# Altium schematic sheet system_bus.SchDoc
size A4
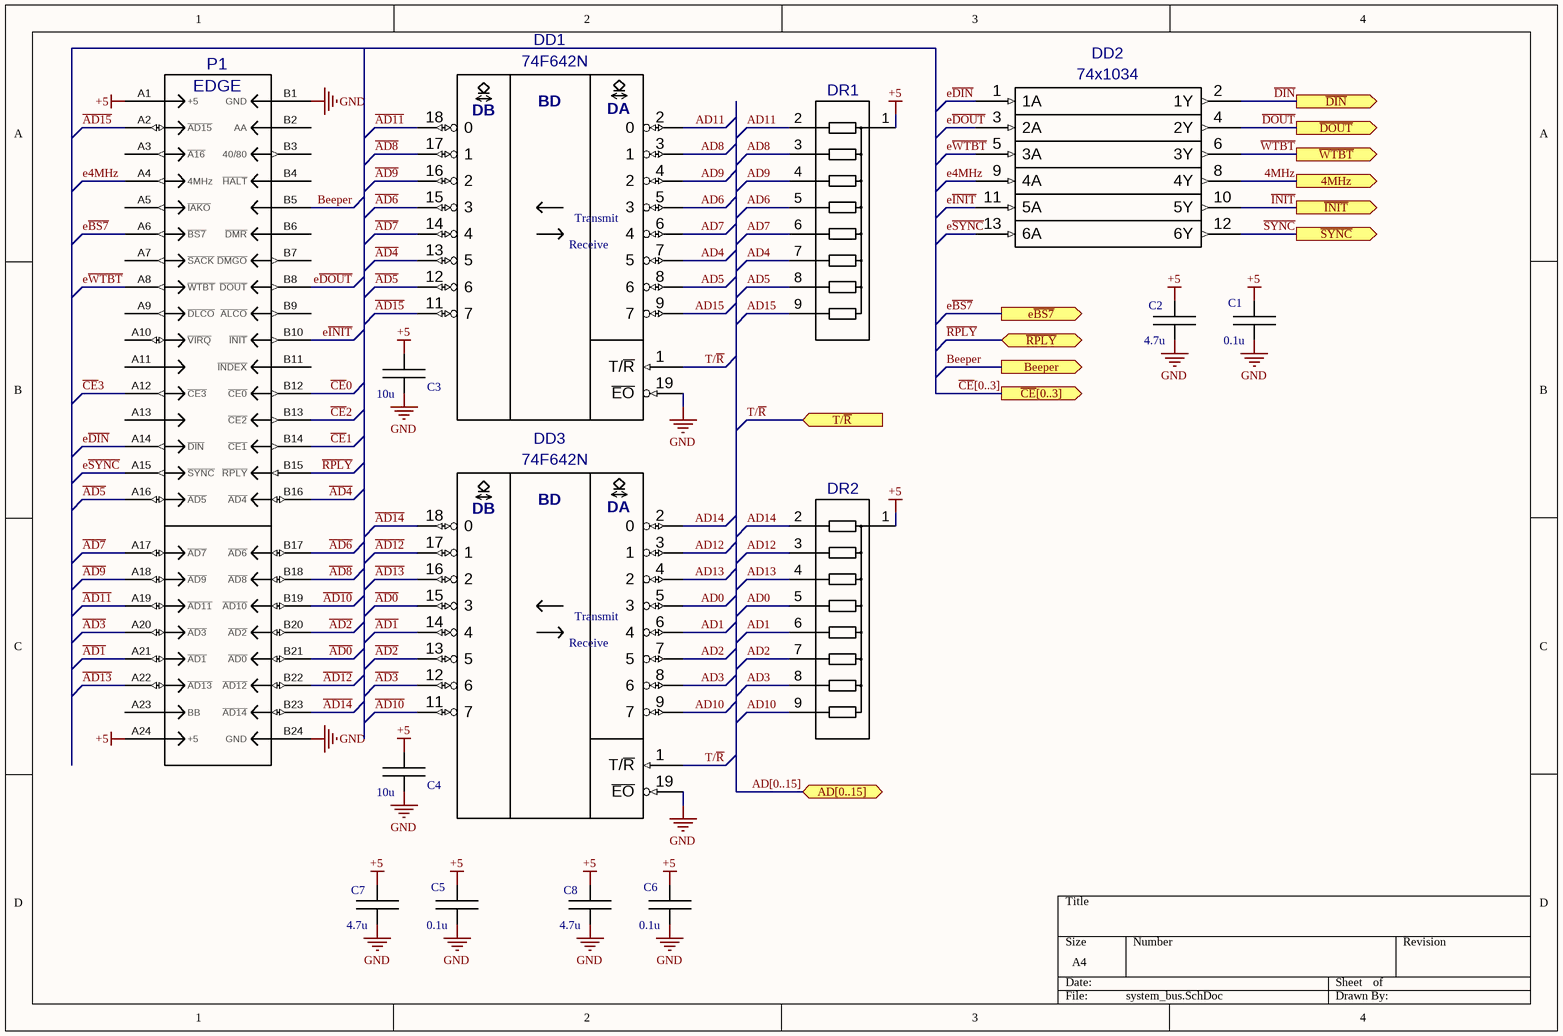
[diagram p0: system_bus.SchDoc]

## Parts
C1  0.1u  [CAP 4x2.5]
C2  4.7u  [CAP 5.5x3.15]
C3  10u  [CAP 5.5x3.15]
C4  10u  [CAP 5.5x3.15]
C5  0.1u  [CAP 4x2.5]
C6  0.1u  [CAP 4x2.5]
C7  4.7u  [CAP 5.5x3.15]
C8  4.7u  [CAP 5.5x3.15]
DD1  74F642N  [DIP20]
DD2  74x1034  [DIP14]
DD3  74F642N  [DIP20]
DR1  RNA8  [SIP9]  (value not drawn)
DR2  RNA8  [SIP9]  (value not drawn)
P1  EDGE  [SNP15-48 EDGE]

## Ports
4MHz (out), AD[0..15] (bidir), Beeper (out), e~{BS7} (out), T/~{R} (in), ~{CE}[0..3] (out), ~{DIN} (out), ~{DOUT} (out), ~{INIT} (out), ~{RPLY} (bidir), ~{SYNC} (out), ~{WTBT} (out)

## Nets
+5: C1.2 C2.2 C3.2 C4.2 C5.2 C6.2 C7.2 C8.2 DD1.20(Vcc) DD2.14(+5) DD3.20(Vcc) DR1.1 DR2.1 P1.A1(+5) P1.A24(+5)
GND: C1.1 C2.1 C3.1 C4.1 C5.1 C6.1 C7.1 C8.1 DD1.10(GND) DD1.19(~{EO}) DD2.7(GND) DD3.10(GND) DD3.19(~{EO}) P1.B1(GND) P1.B24(GND)
4MHz: DD2.8(4Y) ; port 4MHz
~{AD0}: DD3.15(3) P1.B21(~{AD0})
~{AD1}: DD3.14(4) P1.A21(~{AD1})
~{AD10}: DD3.11(7) P1.B19(~{AD10})
~{AD11}: DD1.18(0) P1.A19(~{AD11})
~{AD12}: DD3.17(1) P1.B22(~{AD12})
~{AD13}: DD3.16(2) P1.A22(~{AD13})
~{AD14}: DD3.18(0) P1.B23(~{AD14})
~{AD15}: DD1.11(7) P1.A2(~{AD15})
~{AD2}: DD3.13(5) P1.B20(~{AD2})
~{AD3}: DD3.12(6) P1.A20(~{AD3})
~{AD4}: DD1.13(5) P1.B16(~{AD4})
~{AD5}: DD1.12(6) P1.A16(~{AD5})
~{AD6}: DD1.15(3) P1.B17(~{AD6})
~{AD7}: DD1.14(4) P1.A17(~{AD7})
~{AD8}: DD1.17(1) P1.B18(~{AD8})
~{AD9}: DD1.16(2) P1.A18(~{AD9})
AD0: DD3.5(3) DR2.5
AD1: DD3.6(4) DR2.6
AD2: DD3.7(5) DR2.7
AD3: DD3.8(6) DR2.8
AD4: DD1.7(5) DR1.7
AD5: DD1.8(6) DR1.8
AD6: DD1.5(3) DR1.5
AD7: DD1.6(4) DR1.6
AD8: DD1.3(1) DR1.3
AD9: DD1.4(2) DR1.4
AD10: DD3.9(7) DR2.9
AD11: DD1.2(0) DR1.2
AD12: DD3.3(1) DR2.3
AD13: DD3.4(2) DR2.4
AD14: DD3.2(0) DR2.2
AD15: DD1.9(7) DR1.9
Beeper: P1.B5 ; port Beeper
~{CE}0: P1.B12(~{CE0})
~{CE}1: P1.B14(~{CE1})
~{CE}2: P1.B13(~{CE2})
~{CE}3: P1.A12(~{CE3})
~{DIN}: DD2.2(1Y) ; port ~{DIN}
~{DOUT}: DD2.4(2Y) ; port ~{DOUT}
e4MHz: DD2.9(4A) P1.A4(4MHz)
e~{BS7}: P1.A6(~{BS7}) ; port e~{BS7}
e~{DIN}: DD2.1(1A) P1.A14(~{DIN})
e~{DOUT}: DD2.3(2A) P1.B8(~{DOUT})
e~{INIT}: DD2.11(5A) P1.B10(~{INIT})
e~{SYNC}: DD2.13(6A) P1.A15(~{SYNC})
e~{WTBT}: DD2.5(3A) P1.A8(~{WTBT})
~{INIT}: DD2.10(5Y) ; port ~{INIT}
~{RPLY}: P1.B15(~{RPLY}) ; port ~{RPLY}
~{SYNC}: DD2.12(6Y) ; port ~{SYNC}
T/~{R}: DD1.1(T/~{R}) DD3.1(T/~{R}) ; port T/~{R}
~{WTBT}: DD2.6(3Y) ; port ~{WTBT}

Not connected (* = marked no-connect by the designer): P1 A3(~{A16}) A5(~{IAKO}) A7(~{SACK}) A9(~{DLCO}) A10(~{VIRQ}) A11 A13 A23(BB) B2(AA) B3(40/80) B4(~{HALT}) B6(~{DMR}) B7(~{DMGO}) B9(~{ALCO}) B11(~{INDEX})

## Buses and harness runs
bus AD[0..15] = port AD[0..15]
bus ~{CE}[0..3] = port ~{CE}[0..3]

## Notes on the sheet
- (in symbol 74x642) BD; DA; DB; Transmit; Receive

## Library data of the parts
C1-C8 = Cap: Murata ceramic capacitor
DD1 DD3 = 74x642: Value: *
DD2 = 74x1034 IEEE: ЛП19 6 buffers; Value: *
P1 = SNP15-48 EDGE: Value: *